# EAGLE design Z80_Sound_3 (EAGLE 5.10)
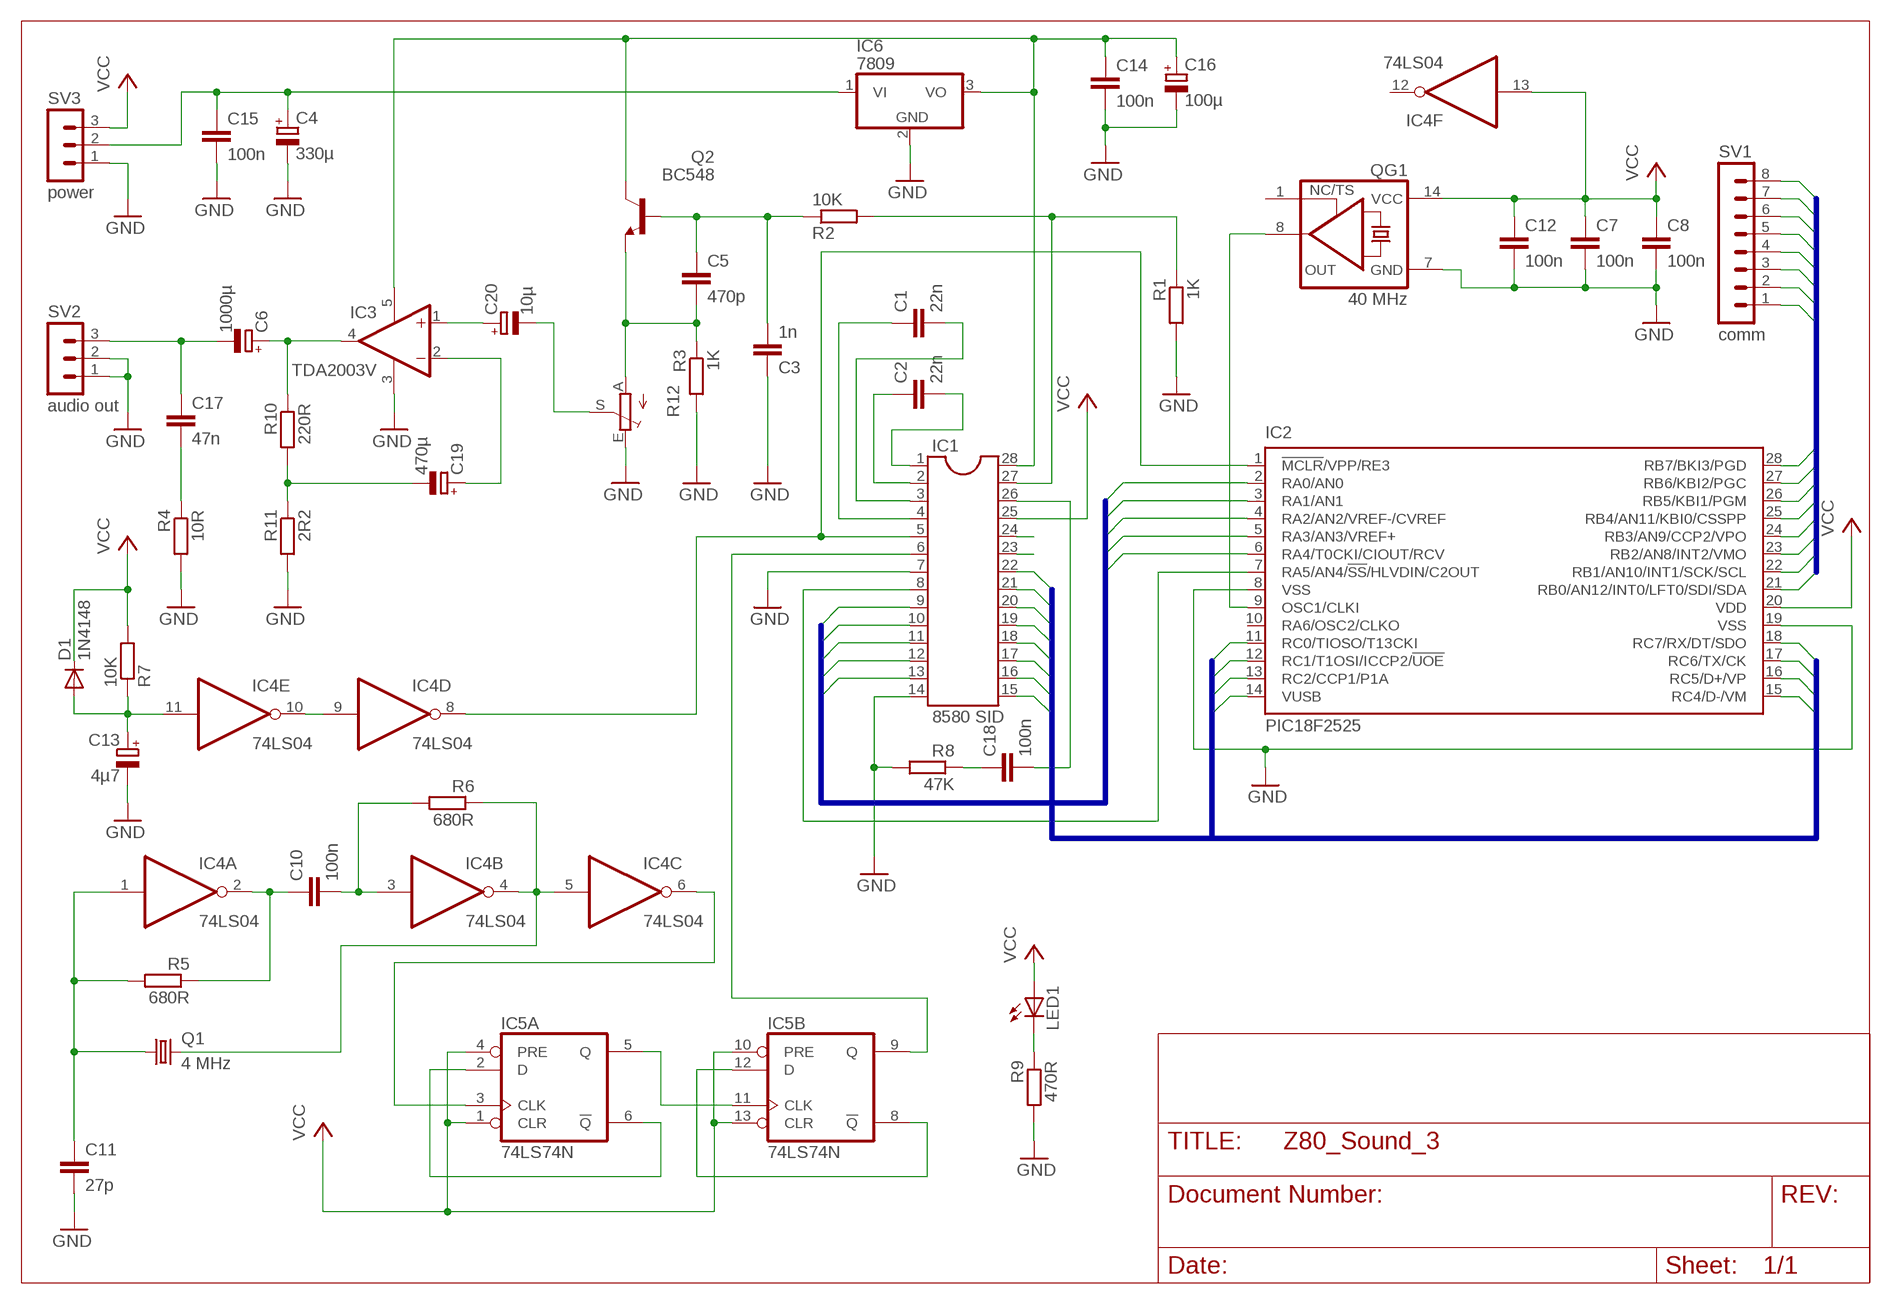
[diagram p0: schematic, sheet 1]

## Parts
C1  22n  C-EU050-035X075  [C050-035X075]
C2  22n  C-EU050-035X075  [C050-035X075]
C3  1n  C-EU050-035X075  [C050-035X075]
C4  330µ  CPOL-EUE3.5-8  [E3,5-8]
C5  470p  C-EU025-024X044  [C025-024X044]
C6  1000µ  CPOL-EUE3.5-10  [E3,5-10]
C7  100n  C-EU050-030X075  [C050-030X075]
C8  100n  C-EU050-030X075  [C050-030X075]
C10  100n  C-EU050-030X075  [C050-030X075]
C11  27p  C-EU025-024X044  [C025-024X044]
C12  100n  C-EU050-030X075  [C050-030X075]
C13  4µ7  CPOL-EUE3.5-8  [E3,5-8]
C14  100n  C-EU050-030X075  [C050-030X075]
C15  100n  C-EU050-030X075  [C050-030X075]
C16  100µ  CPOL-EUE3.5-8  [E3,5-8]
C17  47n  C-EU050-030X075  [C050-030X075]
C18  100n  C-EU050-030X075  [C050-030X075]
C19  470µ  CPOL-EUE3.5-10  [E3,5-10]
C20  10µ  CPOL-EUE3.5-8  [E3,5-8]
D1  1N4148  1N4148DO35-7  [DO35-7]
IC1  8580 SID  DIL28  [DIL28-6]
IC2  PIC18F2525  PIC18F2455_28DIP  [DIL28-3]
IC3  TDA2003V  [CB360]
IC4  74LS04  74LS04N  [DIL14]
IC5  74LS74N  [DIL14]
IC6  7809  786TV  [TO220V]
LED1  LED5MM  [LED5MM]
Q1  4 MHz  CRYSTALHC49S  [HC49/S]
Q2  BC548  [TO92-EBC]
QG1  40 MHz  XO-14  [DIL14S]
R1  1K  R-EU_0207/10  [0207/10]
R2  10K  R-EU_0207/10  [0207/10]
R3  1K  R-EU_0207/10  [0207/10]
R4  10R  R-EU_0207/10  [0207/10]
R5  680R  R-EU_0207/10  [0207/10]
R6  680R  R-EU_0207/10  [0207/10]
R7  10K  R-EU_0207/10  [0207/10]
R8  47K  R-EU_0207/10  [0207/10]
R9  470R  R-EU_0207/10  [0207/10]
R10  220R  R-EU_0207/10  [0207/10]
R11  2R2  R-EU_0207/10  [0207/10]
R12  TRIM_EU-LI15  [LI15]
SV1  comm  MA08-1  [MA08-1]
SV2  audio out  MA03-1  [MA03-1]
SV3  power  MA03-1  [MA03-1]

## Nets
+12V: C4.+ C15.1 IC6.1(VI) SV3.2
/CS: IC1.8 IC2.7(RA5/AN4/!SS!/HLVDIN/C2OUT)
/RES: IC1.5 IC2.1(!MCLR!/VPP/RE3) IC4.8(D:O)
A0: IC1.9 IC2.2(RA0/AN0)
A1: IC1.10 IC2.3(RA1/AN1)
A2: IC1.11 IC2.4(RA2/AN2/VREF-/CVREF)
A3: IC1.12 IC2.5(RA3/AN3/VREF+)
A4: IC1.13 IC2.6(RA4/T0CKI/CIOUT/RCV)
AUDIO_OUT: IC1.27 R1.1 R2.2
CAP1A: C2.2 IC1.1
CAP1B: C2.1 IC1.2
CAP2A: C1.2 IC1.3
CAP2B: C1.1 IC1.4
CLK_1MHZ: IC1.6 IC5.9(B:Q)
D0: IC1.15 IC2.11(RC0/TIOSO/T13CKI)
D1: IC1.16 IC2.12(RC1/T1OSI/ICCP2/!UOE)
D2: IC1.17 IC2.13(RC2/CCP1/P1A)
D3: IC1.18 IC2.14(VUSB)
D4: IC1.19 IC2.15(RC4/D-/VM)
D5: IC1.20 IC2.16(RC5/D+/VP)
D6: IC1.21 IC2.17(RC6/TX/CK)
D7: IC1.22 IC2.18(RC7/RX/DT/SDO)
GND: C3.1 C4.- C7.2 C8.2 C11.2 C12.2 C13.- C14.2 C15.2 C16.- IC1.7 IC1.14 IC2.8(VSS) IC2.19(VSS) IC3.3(GND) IC6.2(GND) QG1.7(GND) R1.2 R3.2 R4.2 R8.2 R9.2 R11.2 R12.E SV2.1 SV2.2 SV3.1
N$1: IC2.9(OSC1/CLKI) QG1.8(OUT)
N$2: IC4.4(B:O) IC4.5(C:I) Q1.2 R6.1
N$3: C5.2 Q2.E R3.1 R12.A
N$4: LED1.K(C) R9.1
N$5: C6.- C17.1 SV2.3
N$6: C3.2 C5.1 Q2.B R2.1
N$7: C6.+ IC3.4(OUT) R10.1
N$8: C17.2 R4.1
N$10: C19.- R10.2 R11.1
N$11: C11.1 IC4.1(A:I) Q1.1 R5.2
N$12: IC5.2(A:D) IC5.6(A:!Q)
N$13: IC5.8(B:!Q) IC5.12(B:D)
N$14: IC4.6(C:O) IC5.3(A:CLK)
N$15: IC5.5(A:Q) IC5.11(B:CLK)
N$16: IC4.9(D:I) IC4.10(E:O)
N$17: C13.+ D1.A IC4.11(E:I) R7.1
N$18: C10.1 IC4.2(A:O) R5.1
N$19: C10.2 IC4.3(B:I) R6.2
N$20: C18.2 IC1.26
N$23: C18.1 R8.1
N$25: C19.+ IC3.2(-IN)
N$26: C20.+ IC3.1(+IN)
N$28: C20.- R12.S
POTX: IC1.24
POTY: IC1.23
RB0: IC2.21(RB0/AN12/INT0/LFT0/SDI/SDA) SV1.1
RB1: IC2.22(RB1/AN10/INT1/SCK/SCL) SV1.2
RB2: IC2.23(RB2/AN8/INT2/VMO) SV1.3
RB3: IC2.24(RB3/AN9/CCP2/VPO) SV1.4
RB4: IC2.25(RB4/AN11/KBI0/CSSPP) SV1.5
RB5: IC2.26(RB5/KBI1/PGM) SV1.6
RB6: IC2.27(RB6/KBI2/PGC) SV1.7
RB7: IC2.28(RB7/BKI3/PGD) SV1.8
VCC: C7.1 C8.1 C12.1 D1.C IC1.25 IC2.20(VDD) IC4.13(F:I) IC5.1(A:CLR) IC5.4(A:PRE) IC5.10(B:PRE) IC5.13(B:CLR) LED1.A QG1.14(VCC) R7.2 SV3.3
VDD: C14.1 C16.+ IC1.28 IC3.5(V+) IC6.3(VO) Q2.C
Unconnected: IC2.10(RA6/OSC2/CLKO) IC4.12(F:O) QG1.1(TS)

## Buses
D[0..7]
RB[0..7]
A[0..4]

## Power pins joined to a net without a drawn wire
GND: IC4.7(P:GND) IC5.7(P:GND)
VCC: IC4.14(P:VCC) IC5.14(P:VCC)

## Library data of the parts
C1-C3 C5 C7 C8 C10-C12 C14 C15 C17 C18 = rcl:C-EU: CAPACITOR, European symbol
C4 C6 C13 C16 C19 C20 = rcl:CPOL-EU: POLARIZED CAPACITOR, European symbol
D1 = diode:1N4148: DIODE high speed (Philips)
IC1 = ic-package:DIL28: Dual In Line
IC2 = microchip:PIC18F2*_28: USB Microcontrollers with nanoWatt Technology High-Performance, Enhanced Flash, 28/40/44-Pin, Source: http://ww1.microchip.com/downloads/en/devicedoc/39632c.pdf
IC3 = linear:TDA2003: AUDIO AMPLIFIER
IC4 = 74xx-us:74*04: Hex INVERTER
IC5 = 74xx-us:74*74: Dual D type positive edge triggered FLIP FLOP, preset and clear
IC6 = linear:78*: Positive VOLTAGE REGULATOR Source: http://cache.national.com/ds/LM/LM78L05.pdf http://www.fairchildsemi.com/ds/LM/LM7805.pdf
LED1 = led:LED: LED OSRAM: - CHIPLED LG R971, LG N971, LY N971, LG Q971, LY Q971, LO R971, LY R971 LH N974, LH R974 LS Q976, LO Q976, LY Q976 LO Q996 - Hyper CHIPLED LW Q18S LB Q993, LB Q99A, LB R99A - SideLED LS A670, LO A670, LY A670, LG A670, LP A670 LB A673, LV A673, LT A673, LW A673 LH A674 LY A675 LS A676, LA A676, LO A676, LY A676, LW A676 LS A679, LY A679, LG A679 - Hyper Micro SIDELED® LS Y876, LA Y876, LO Y876, LY Y876 LT Y87S - SmartLED LW L88C, LW L88S LB L89C, LB L89S, LG L890 LS L89K, LO L89K, LY L89K LS L896, LA L896, LO L896, LY L896 - TOPLED LS T670, LO T670, LY T670, LG T670, LP T670 LSG T670, LSP T670, LSY T670, LOP T670, LYG T670 LG T671, LOG T671, LSG T671 LB T673, LV T673, LT T673, LW T673 LH T674 LS T676, LA T676, LO T676, LY T676, LB T676, LH T676, LSB T676, LW T676 LB T67C, LV T67C, LT T67C, LS T67K, LO T67K, LY T67K, LW E67C LS E67B, LA E67B, LO E67B, LY E67B, LB E67C, LV E67C, LT E67C LW T67C LS T679, LY T679, LG T679 LS T770, LO T770, LY T770, LG T770, LP T770 LB T773, LV T773, LT T773, LW T773 LH T774 LS E675, LA E675, LY E675, LS T675 LS T776, LA T776, LO T776, LY T776, LB T776 LHGB T686 LT T68C, LB T68C - Hyper Mini TOPLED® LB M676 - Mini TOPLED Santana® LG M470 LS M47K, LO M47K, LY M47K Source: http://www.osram.convergy.de LUXEON: - LUMILED® LXK2-PW12-R00, LXK2-PW12-S00, LXK2-PW14-U00, LXK2-PW14-V00 LXK2-PM12-R00, LXK2-PM12-S00, LXK2-PM14-U00 LXK2-PE12-Q00, LXK2-PE12-R00, LXK2-PE12-S00, LXK2-PE14-T00, LXK2-PE14-U00 LXK2-PB12-K00, LXK2-PB12-L00, LXK2-PB12-M00, LXK2-PB14-N00, LXK2-PB14-P00, LXK2-PB14-Q00 LXK2-PR12-L00, LXK2-PR12-M00, LXK2-PR14-Q00, LXK2-PR14-R00 LXK2-PD12-Q00, LXK2-PD12-R00, LXK2-PD12-S00 LXK2-PH12-R00, LXK2-PH12-S00 LXK2-PL12-P00, LXK2-PL12-Q00, LXK2-PL12-R00 Source: www.luxeon.com KINGBRIGHT: KA-3528ASYC Source: www.kingbright.com
Q1 = crystal:CRYSTAL: CRYSTAL
Q2 = transistor-npn:BC548*: NPN Transistor
QG1 = crystal:XO-: CRYSTAL
R1-R11 = rcl:R-EU_: RESISTOR, European symbol
R12 = pot:TRIM_EU-: POTENTIOMETER
SV1 = con-lstb:MA08-1: PIN HEADER
SV2 SV3 = con-lstb:MA03-1: PIN HEADER

## Board
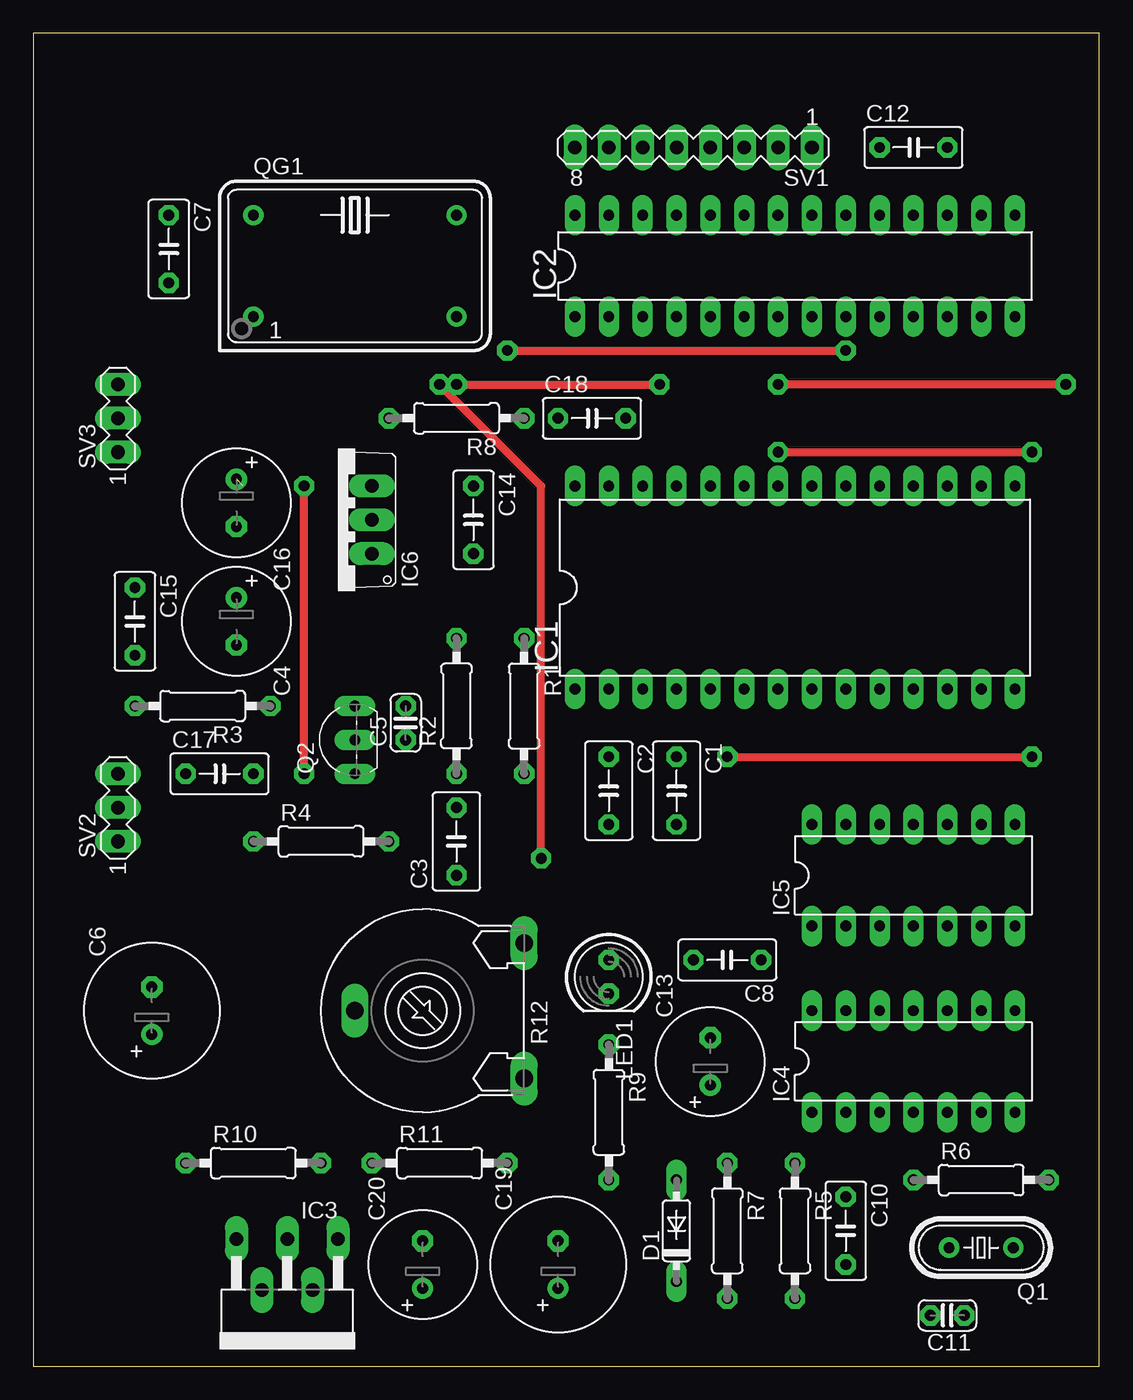
[diagram p1: board, top side]
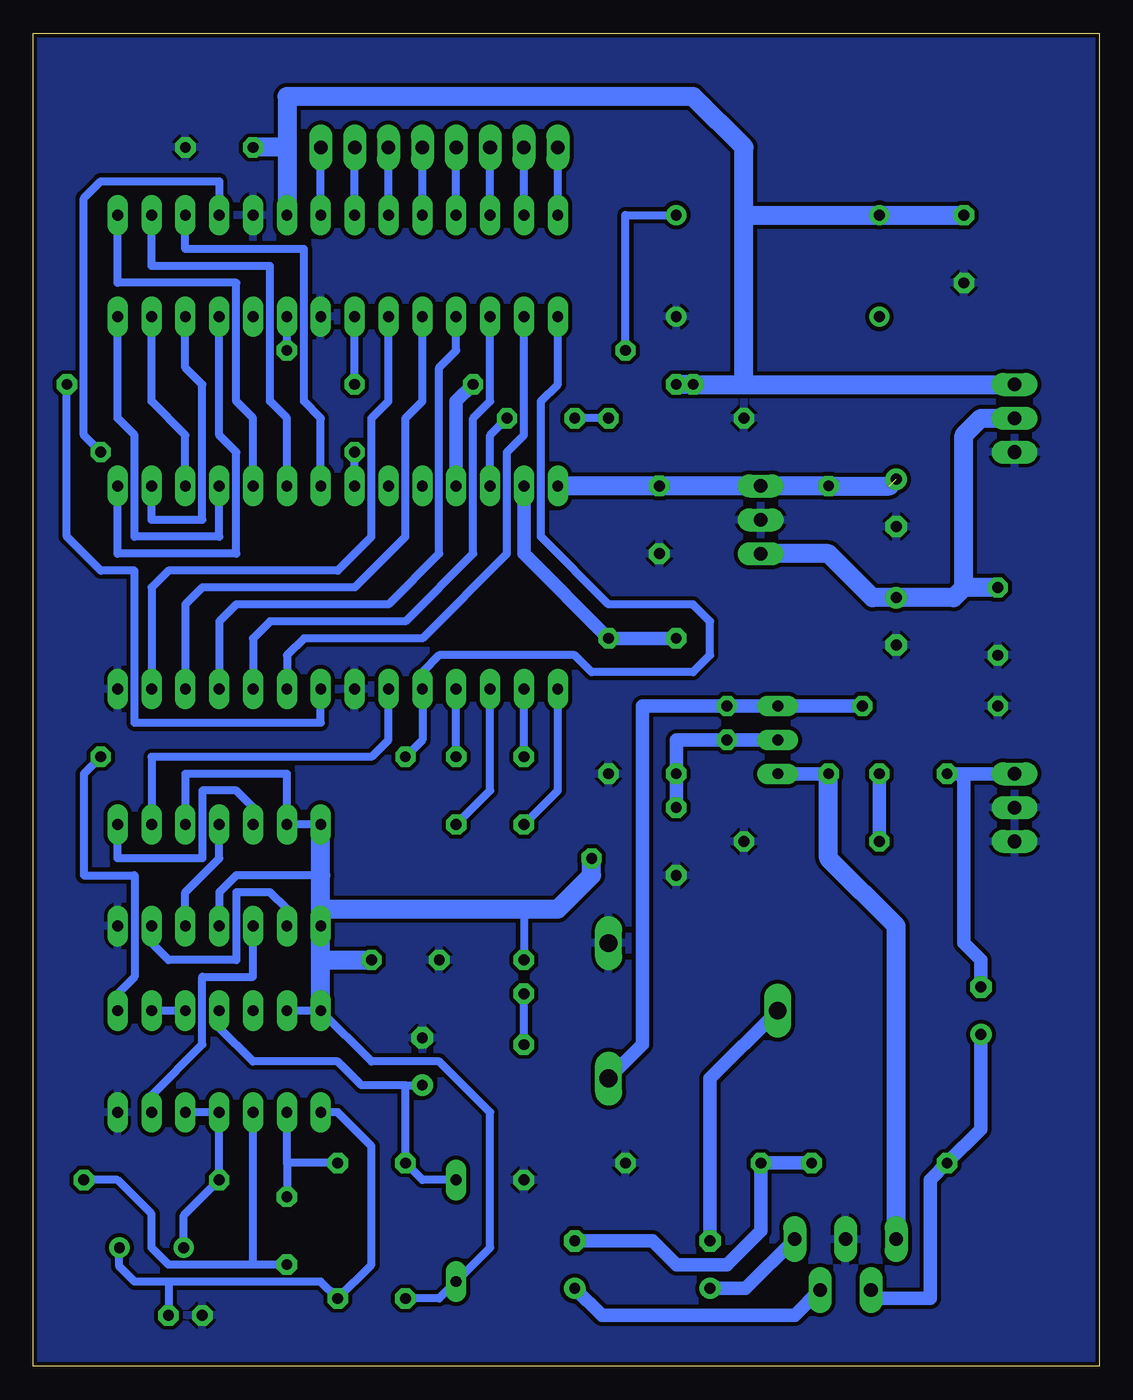
[diagram p2: board, bottom side, seen from below]

Size 79.99 x 100 mm. Coordinates in mm from the lower left corner, seen from the top.
Outline: 0,0 79.99,0 79.99,100 0,100 0,0
Copper layers (1*16): Top 0.035mm / dielectric 1.5mm / Bottom 0.035mm
Design rules "default *": minimum track width 10mil, minimum drill 24mil, track to track 12mil, track to pad 12mil, pad to pad 8mil, via to via 8mil, smd to smd 8mil, copper to edge 12mil, drill to drill 8mil, minimum pad ring 14mil, minimum via ring 14mil, stop-mask expansion 4mil, vias tented up to drill 0mil, thermal gap 10mil

### Footprints (pad centres in the part's own frame; a part is rotated, then mirrored left to right if it is on the bottom)
C050-035X075 = drill 0.813 octagon: 1 -2.54,0; 2 2.54,0
E3,5-8 = drill 0.813 pad 1.6 round: + -1.778,0 | drill 0.813 pad 1.6 octagon: - 1.778,0
C025-024X044 = drill 0.813 octagon: 1 -1.27,0; 2 1.27,0
E3,5-10 = drill 0.813 pad 1.6 round: + -1.778,0 | drill 0.813 pad 1.6 octagon: - 1.778,0
C050-030X075 = drill 0.813 octagon: 1 -2.54,0; 2 2.54,0
DO35-7 = drill 0.813 long: A 3.81,0; C -3.81,0
DIL28-6 = drill 0.813 long: 1 -16.51,-7.62; 2 -13.97,-7.62; 3 -11.43,-7.62; 4 -8.89,-7.62; 5 -6.35,-7.62; 6 -3.81,-7.62; 7 -1.27,-7.62; 8 1.27,-7.62; 9 3.81,-7.62; 10 6.35,-7.62; 11 8.89,-7.62; 12 11.43,-7.62; 13 13.97,-7.62; 14 16.51,-7.62; 15 16.51,7.62; 16 13.97,7.62; 17 11.43,7.62; 18 8.89,7.62; 19 6.35,7.62; 20 3.81,7.62; 21 1.27,7.62; 22 -1.27,7.62; 23 -3.81,7.62; 24 -6.35,7.62; 25 -8.89,7.62; 26 -11.43,7.62; 27 -13.97,7.62; 28 -16.51,7.62
DIL28-3 = drill 0.813 long: 1 -16.51,-3.81; 2 -13.97,-3.81; 3 -11.43,-3.81; 4 -8.89,-3.81; 5 -6.35,-3.81; 6 -3.81,-3.81; 7 -1.27,-3.81; 8 1.27,-3.81; 9 3.81,-3.81; 10 6.35,-3.81; 11 8.89,-3.81; 12 11.43,-3.81; 13 13.97,-3.81; 14 16.51,-3.81; 15 16.51,3.81; 16 13.97,3.81; 17 11.43,3.81; 18 8.89,3.81; 19 6.35,3.81; 20 3.81,3.81; 21 1.27,3.81; 22 -1.27,3.81; 23 -3.81,3.81; 24 -6.35,3.81; 25 -8.89,3.81; 26 -11.43,3.81; 27 -13.97,3.81; 28 -16.51,3.81
CB360 = drill 1.016 long: 1 -3.81,-8.255; 2 -1.905,-4.445; 3 0,-8.255; 4 1.905,-4.445; 5 3.81,-8.255
DIL14 = drill 0.813 long: 1 -7.62,-3.81; 2 -5.08,-3.81; 3 -2.54,-3.81; 4 0,-3.81; 5 2.54,-3.81; 6 5.08,-3.81; 7 7.62,-3.81; 8 7.62,3.81; 9 5.08,3.81; 10 2.54,3.81; 11 0,3.81; 12 -2.54,3.81; 13 -5.08,3.81; 14 -7.62,3.81
TO220V = drill 1.016 long: 1 -2.54,-2.54; 2 0,-2.54; 3 2.54,-2.54
LED5MM = drill 0.813 octagon: A -1.27,0; K 1.27,0
HC49/S = drill 0.813 round: 1 -2.413,0; 2 2.413,0
TO92-EBC = drill 0.813 long: B 0,-1.27; C -2.54,-1.27; E 2.54,-1.27
DIL14S = drill 0.813 round: 1 -7.62,-3.81; 7 7.62,-3.81; 8 7.62,3.81; 14 -7.62,3.81
0207/10 = drill 0.813 octagon: 1 -5.08,0; 2 5.08,0
LI15 = drill 1.321 long: A -5.08,-7.62; E 5.08,-7.62; S 0,5.08
MA08-1 = drill 1.016 long: 1 -8.89,0; 2 -6.35,0; 3 -3.81,0; 4 -1.27,0; 5 1.27,0; 6 3.81,0; 7 6.35,0; 8 8.89,0
MA03-1 = drill 1.016 long: 1 -2.54,0; 2 0,0; 3 2.54,0

### Placement (x,y rotation side)
C1  48.26,43.18 270 top
C2  43.18,43.18 270 top
C3  31.75,39.37 90 top
C4  15.24,55.88 270 top
C5  27.94,48.26 90 top
C6  8.89,26.67 90 top
C7  10.16,83.82 270 top
C8  52.07,30.48 180 top
C10  60.96,10.16 270 top
C11  68.58,3.81 180 top
C12  66.04,91.44 0 top
C13  50.8,22.86 90 top
C14  33.02,63.5 270 top
C15  7.62,55.88 270 top
C16  15.24,64.77 270 top
C17  13.97,44.45 0 top
C18  41.91,71.12 0 top
C19  39.37,7.62 90 top
C20  29.21,7.62 90 top
D1  48.26,10.16 90 top
IC1  57.15,58.42 0 top
IC2  57.15,82.55 0 top
IC3  19.05,1.27 180 top
IC4  66.04,22.86 0 top
IC5  66.04,36.83 0 top
IC6  22.86,63.5 90 top
LED1  43.18,29.21 270 top
Q1  71.12,8.89 180 top
Q2  22.86,46.99 90 top
QG1  24.13,82.55 0 top
R1  36.83,49.53 270 top
R2  31.75,49.53 90 top
R3  12.7,49.53 180 top
R4  21.59,39.37 0 top
R5  57.15,10.16 270 top
R6  71.12,13.97 0 top
R7  52.07,10.16 270 top
R8  31.75,71.12 180 top
R9  43.18,19.05 270 top
R10  16.51,15.24 0 top
R11  30.48,15.24 0 top
R12  29.21,26.67 90 top
SV1  49.53,91.44 180 top
SV2  6.35,41.91 90 top
SV3  6.35,71.12 90 top

### Tracks (layer width: path | path; a pad name or v marks a point on that pad's centre or on a via)
+12V
  Bottom 1.422: 10.16,58.42 10.92,57.66 C4.+ 17.02,57.66 20.32,60.96 IC6.1 | 10.16,58.42 10.16,69.85 8.89,71.12 SV3.2 | C15.1 10.16,58.42
/CS  (via drill 0.8)
  Top 0.61: v77.47,73.66 v55.88,73.66
  Bottom 0.61: v55.88,73.66 IC2.7 | IC1.8 58.42,48.26 72.39,48.26 72.39,59.69 74.93,59.69 77.47,62.23 v77.47,73.66
/RES  (via drill 0.8)
  Top 0.61: v52.07,45.72 v74.93,45.72
  Bottom 0.61: IC2.1 40.64,73.66 41.91,72.39 41.91,62.23 36.83,57.15 30.48,57.15 29.21,55.88 29.21,53.34 30.48,52.07 38.1,52.07 39.37,53.34 49.53,53.34 50.8,52.07 IC1.5 50.8,46.99 v52.07,45.72 | IC4.8 73.66,27.94 72.39,29.21 72.39,36.83 76.2,36.83 76.2,44.45 v74.93,45.72
A0
  Bottom 0.61: IC1.9 60.96,53.34 59.69,54.61 50.8,54.61 44.45,60.96 44.45,68.58 43.18,69.85 IC2.2
A1
  Bottom 0.61: IC1.10 63.5,54.61 62.23,55.88 52.07,55.88 46.99,60.96 46.99,71.12 45.72,72.39 IC2.3
A2
  Bottom 0.61: IC1.11 66.04,55.88 64.77,57.15 53.34,57.15 49.53,60.96 49.53,74.93 48.26,76.2 IC2.4
A3
  Bottom 0.61: IC1.12 68.58,57.15 67.31,58.42 55.88,58.42 52.07,62.23 52.07,71.12 50.8,72.39 IC2.5
A4
  Bottom 0.61: IC2.6 53.34,72.39 54.61,71.12 54.61,62.23 57.15,59.69 69.85,59.69 71.12,58.42 IC1.13
AUDIO_OUT
  Bottom 1.016: IC1.27 43.18,60.96 R1.1 R2.2
CAP1A
  Bottom 0.61: IC1.1 40.64,43.18 C2.2
CAP1B
  Bottom 0.61: C2.1 IC1.2
CAP2A
  Bottom 0.61: IC1.3 45.72,43.18 C1.2
CAP2B
  Bottom 0.61: C1.1 IC1.4
CLK_1MHZ
  Bottom 0.61: IC5.9 71.12,45.72 54.61,45.72 53.34,46.99 IC1.6
D0
  Bottom 0.61: IC2.11 66.04,69.85 64.77,68.58 64.77,60.96 73.66,60.96 IC1.15
D1
  Bottom 0.61: IC1.16 71.12,63.5 67.31,63.5 67.31,73.66 68.58,74.93 IC2.12
D2
  Bottom 0.61: IC2.13 71.12,72.39 68.58,69.85 IC1.17
D3
  Bottom 0.61: IC1.18 66.04,62.23 72.39,62.23 72.39,69.85 73.66,71.12 IC2.14
D4
  Bottom 0.61: IC1.19 63.5,71.12 64.77,72.39 64.77,81.28 73.66,81.28 IC2.15
D5
  Bottom 0.61: IC2.16 71.12,82.55 62.23,82.55 62.23,72.39 60.96,71.12 IC1.20
D6
  Bottom 0.61: IC2.17 68.58,83.82 59.69,83.82 59.69,72.39 58.42,71.12 IC1.21
D7  (via drill 0.8)
  Top 0.61: v55.88,68.58 v74.93,68.58
  Bottom 0.61: IC2.18 66.04,88.9 74.93,88.9 76.2,87.63 76.2,69.85 v74.93,68.58 | IC1.22 v55.88,68.58
GND
  pour Bottom: 0,100.33 0,0 80.01,0 80.01,100.33
N$1  (via drill 0.8)
  Top 0.61: v35.56,76.2 v60.96,76.2
  Bottom 0.61: v60.96,76.2 IC2.9 | v35.56,76.2 35.56,86.36 QG1.8
N$2
  Bottom 0.61: IC4.5 IC4.4 R6.1 68.71,11.3 Q1.2
N$3
  Bottom 1.016: R3.1 Q2.E C5.2 34.29,49.53 34.29,24.13 R12.A
N$4
  Bottom 0.61: R9.1 LED1.K
N$5
  Bottom 1.016: SV2.3 C17.1 10.16,44.45 10.16,31.75 8.89,30.48 C6.-
N$6
  Bottom 1.016: Q2.B C5.1 31.75,46.99 R2.1 C3.2
N$7
  Bottom 1.016: C6.+ 8.89,17.78 R10.1 12.7,13.97 12.7,5.08 17.14,5.08 IC3.4
N$8
  Bottom 1.016: R4.1 C17.2
N$10
  Bottom 1.016: R10.2 R11.1 25.4,10.16 27.94,7.62 31.75,7.62 33.53,9.4 C19.-
N$11
  Bottom 0.61: Q1.1 73.53,7.49 72.39,6.35 69.85,6.35 | 69.85,6.35 58.42,6.35 R5.2 54.61,7.62 54.61,16.51 57.15,19.05 IC4.1 | 69.85,6.35 C11.1
N$12
  Bottom 0.61: IC5.2 60.96,34.29 62.23,35.56 64.77,35.56 64.77,30.48 69.85,30.48 71.12,31.75 IC5.6
N$13
  Bottom 0.61: IC5.8 73.66,38.1 67.31,38.1 67.31,43.18 64.77,43.18 63.5,41.91 IC5.12
N$14
  Bottom 0.61: IC4.6 71.12,20.32 67.31,24.13 67.31,29.21 63.5,29.21 IC5.3
N$15
  Bottom 0.61: IC5.5 68.58,35.56 66.04,38.1 IC5.11
N$16
  Bottom 0.61: IC4.10 IC4.9
N$17
  Bottom 0.61: 52.07,21.08 C13.+ | 52.07,21.08 55.37,21.08 57.15,22.86 63.5,22.86 66.04,25.4 IC4.11 | D1.A 50.8,13.97 R7.1 52.07,21.08
N$18
  Bottom 0.61: 60.96,15.24 IC4.2 | R5.1 60.96,15.24 | 60.96,15.24 C10.1
N$19
  Bottom 0.61: R6.2 73.66,13.97 71.12,11.43 71.12,8.89 69.85,7.62 63.5,7.62 | C10.2 63.5,7.62 | 63.5,7.62 IC4.3
N$20
  Bottom 0.61: IC1.26 45.72,69.85 C18.2
N$23
  Bottom 0.61: R8.1 C18.1
N$25
  Bottom 1.016: IC3.2 22.86,3.81 37.34,3.81 C19.+
N$26
  Bottom 1.016: C20.+ 26.54,5.84 IC3.1
N$28
  Bottom 1.016: C20.- 29.21,21.59 R12.S
RB0
  Bottom 0.61: IC2.21 SV1.1
RB1
  Bottom 0.61: IC2.22 SV1.2
RB2
  Bottom 0.61: IC2.23 SV1.3
RB3
  Bottom 0.61: IC2.24 SV1.4
RB4
  Bottom 0.61: IC2.25 SV1.5
RB5
  Bottom 0.61: IC2.26 SV1.6
RB6
  Bottom 0.61: IC2.27 SV1.7
RB7
  Bottom 0.61: IC2.28 SV1.8
VCC  (via drill 0.8)
  Top 0.61: v38.1,38.1 38.1,66.04 v30.48,73.66 | v31.75,73.66 v46.99,73.66
  Bottom 0.61: IC5.10 68.58,44.45 60.96,44.45 IC5.13 IC5.14 | 58.42,36.83 64.77,36.83 66.04,35.56 IC5.4 | R7.2 49.53,5.08 D1.C 45.72,8.89 45.72,19.05 49.53,22.86 54.61,22.86 IC4.14 IC4.13 | 43.18,34.29 LED1.A
  Bottom 1.016: IC1.25 48.26,72.39 v46.99,73.66
  Bottom 1.422: IC4.14 58.42,30.48 | 58.42,30.48 IC5.1 58.42,34.29 | 58.42,34.29 58.42,36.83 IC5.14 | C7.1 QG1.14 26.67,86.36 | 60.96,91.44 60.96,95.25 30.48,95.25 26.67,91.44 26.67,86.36 | 60.96,91.44 IC2.20 | 60.96,91.44 C12.1 | 58.42,30.48 C8.1 | 26.67,73.66 SV3.3 | 26.67,73.66 26.67,86.36 | 26.67,73.66 v30.48,73.66 v31.75,73.66 | 58.42,34.29 43.18,34.29 40.64,34.29 38.1,36.83 v38.1,38.1
VDD  (via drill 0.8)  (1 unrouted)
  Top 0.61: v20.32,44.45 v20.32,66.04
  Bottom 1.016: v20.32,44.45 Q2.C
  Bottom 1.422: 15.75,66.04 v20.32,66.04 IC6.3 C14.1 IC1.28 | IC3.5 15.24,33.02 20.32,38.1 v20.32,44.45